# Altium schematic sheet sterownik silników.SchDoc
size A4; SheetNumber: 3; SheetTotal: 7
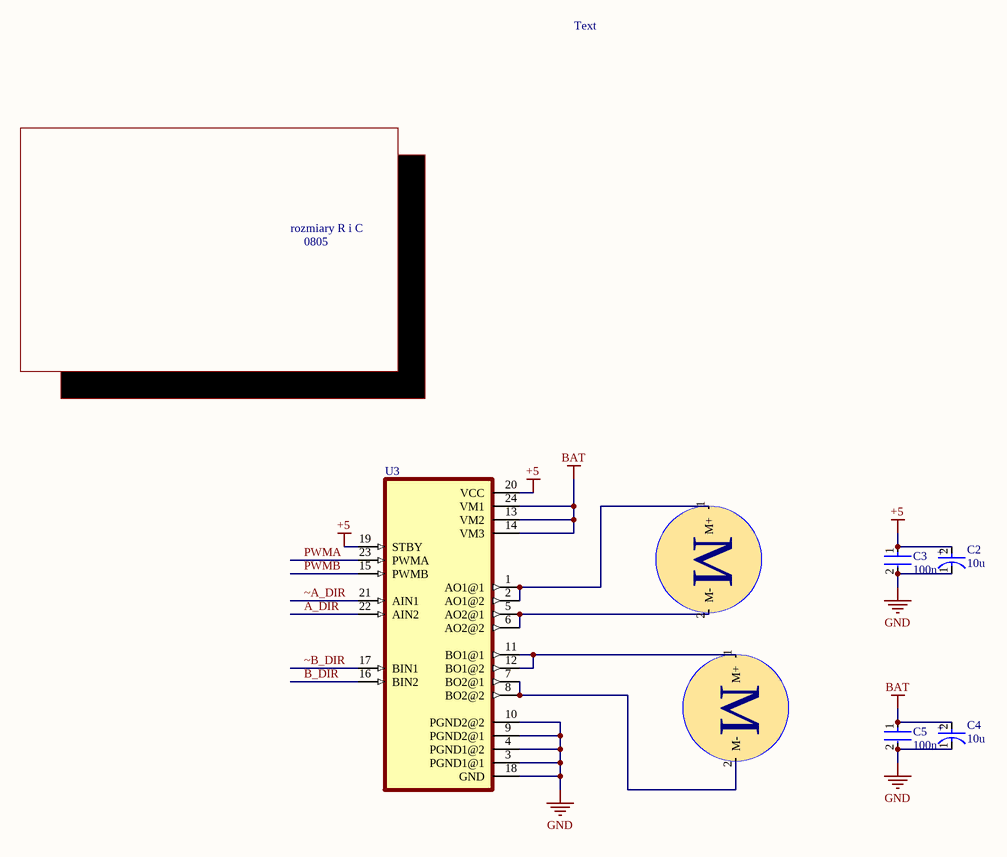
[diagram p0: sterownik silników.SchDoc]

## Parts
(Parts that share a designator on the sheet are numbered #1, #2 ... from top to bottom, then left to right.)
?#1  Component_1  [PCBComponent_1]  (value not drawn)
?#2  Component_1  [PCBComponent_1]  (value not drawn)
C2  10u  [FP-TAJP-MFG]
C3  100n  [FP-0805-L_2_01_0_2-W_1_25-IPC_B]
C4  10u  [FP-TAJP-MFG]
C5  100n  [FP-0805-L_2_01_0_2-W_1_25-IPC_B]
U3  TB6612FNG(O,C,8,EL  [SOP65P760X160-24N]  (value not drawn)

## Nets
+5: C2.2(A) C3.1 U3.19(STBY) U3.20(VCC)
BAT: C4.2(A) C5.1 U3.13(VM2) U3.14(VM3) U3.24(VM1)
GND: C2.1(C) C3.2 C4.1(C) C5.2 U3.3(PGND1@1) U3.4(PGND1@2) U3.9(PGND2@1) U3.10(PGND2@2) U3.18(GND)
A_DIR: U3.22(AIN2)
B_DIR: U3.16(BIN2)
PWMA: U3.23(PWMA)
PWMB: U3.15(PWMB)
~A_DIR: U3.21(AIN1)
~B_DIR: U3.17(BIN1)
Net?#1_1: ?#1.1(M+) U3.1(AO1@1) U3.2(AO1@2)
Net?#1_2: ?#1.2(M-) U3.5(AO2@1) U3.6(AO2@2)
Net?#2_1: ?#2.1(M+) U3.11(BO1@1) U3.12(BO1@2)
Net?#2_2: ?#2.2(M-) U3.7(BO2@1) U3.8(BO2@2)

## Notes on the sheet
- Text
- rozmiary R i C
- 0805
- (in symbol CMP-2007-04028-2) +
- (in symbol Component_1) M

## Library data of the parts
C2 C4 = CMP-2007-04028-2: 10uF 10V  ±20% 6Ω 0805  SMD Tantalum Capacitor; Dissipation Factor: 8%; ESR (Equivalent Series Resistance): 6R; Polarity: Polar; Leakage Current: 1uA; Height: 1.5mm; Packaging: Tape and Reel; Max Operating Temperature: 125°C; Lead Free: Lead Free; Length: 2.05mm; RoHS Compliant: Yes; Number of Pins: 2; Case Code (Metric): 2012; Series: TAJ; Height - Seated (Max): 0.059inch; Mount: Surface Mount; REACH SVHC: No SVHC; Depth: 1.35mm; Tolerance: 20%; Case Code (Imperial): 0805; Dielectric Material: Tantalum; Features: General Purpose; Voltage: 10V; Capacitance: 10uF; Package Quantity: 1; Case/Package: 0805; Voltage Rating (DC): 10V; Termination: SMD/SMT; Width: 0.053inch; Min Operating Temperature: -55°C; Voltage Rating: 10V
C3 C5 = CMP-2007-04174-2: General Purpose Ceramic Capacitor, 0805, 100nF, 10%, X7R, 15%, 100V; Packaging: Tape and Reel; Min Operating Temperature: -55°C; Dielectric Material: Ceramic; Height: 1.4mm; Voltage Rating: 100V; Termination: SMD/SMT; Case Code (Imperial): 0805; Case Code (Metric): 2012; Case/Package: 0805; Construction: Flat; Radiation Hardening: No; Series: -; Dielectric: X7R; Package Quantity: 2000; Mount: Surface Mount; Capacitance: 100nF; Contact Plating: Tin; Voltage: 100V; Lead Free: Lead Free; Depth: 1.25mm; RoHS Compliant: Yes; Number of Pins: 2; Max Operating Temperature: 125°C; Length: 2.01mm; Voltage Rating (DC): 100V; Thickness: 0.055inch; REACH SVHC: No SVHC; Width: 0.049inch; Tolerance: 10%
U3 = TB6612FNG(O,C,8,EL: DC Motor Driver 3V 24-Pin SSOP T/R; MF: Toshiba; Check_prices: https://www.snapeda.com/parts/TB6612FNG(O,C,8,EL/Toshiba/view-part/?ref=eda; Package: SSOP-24 Toshiba; Availability: Not in stock; Value: *; MP: TB6612FNG(O,C,8,EL; SnapEDA_Link: https://www.snapeda.com/parts/TB6612FNG(O,C,8,EL/Toshiba/view-part/?ref=snap; Price: None